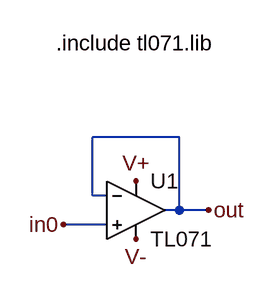
[diagram p0: schematic buffer.asc]
buffer.asc, the LTspice schematic file:
Version 4
SHEET 1 880 680
WIRE -80 48 -176 48
WIRE -176 112 -176 48
WIRE -160 112 -176 112
WIRE -80 128 -80 48
WIRE -80 128 -96 128
WIRE -48 128 -80 128
WIRE -160 144 -208 144
FLAG -208 144 in0
FLAG -48 128 out
FLAG -128 96 V+
FLAG -128 160 V-
SYMBOL opamp2 -128 64 R0
SYMATTR InstName U1
SYMATTR Value TL071
TEXT -216 -56 Left 2 !.include tl071.lib

The netlist it stands for:
* buffer.asc
XU1 in0 out V+ V- out TL071  ; pins In+ In- V+ V- OUT
.include tl071.lib
.backanno
.end